# EAGLE schematic schema_v4_3 (EAGLE 6.5.0)
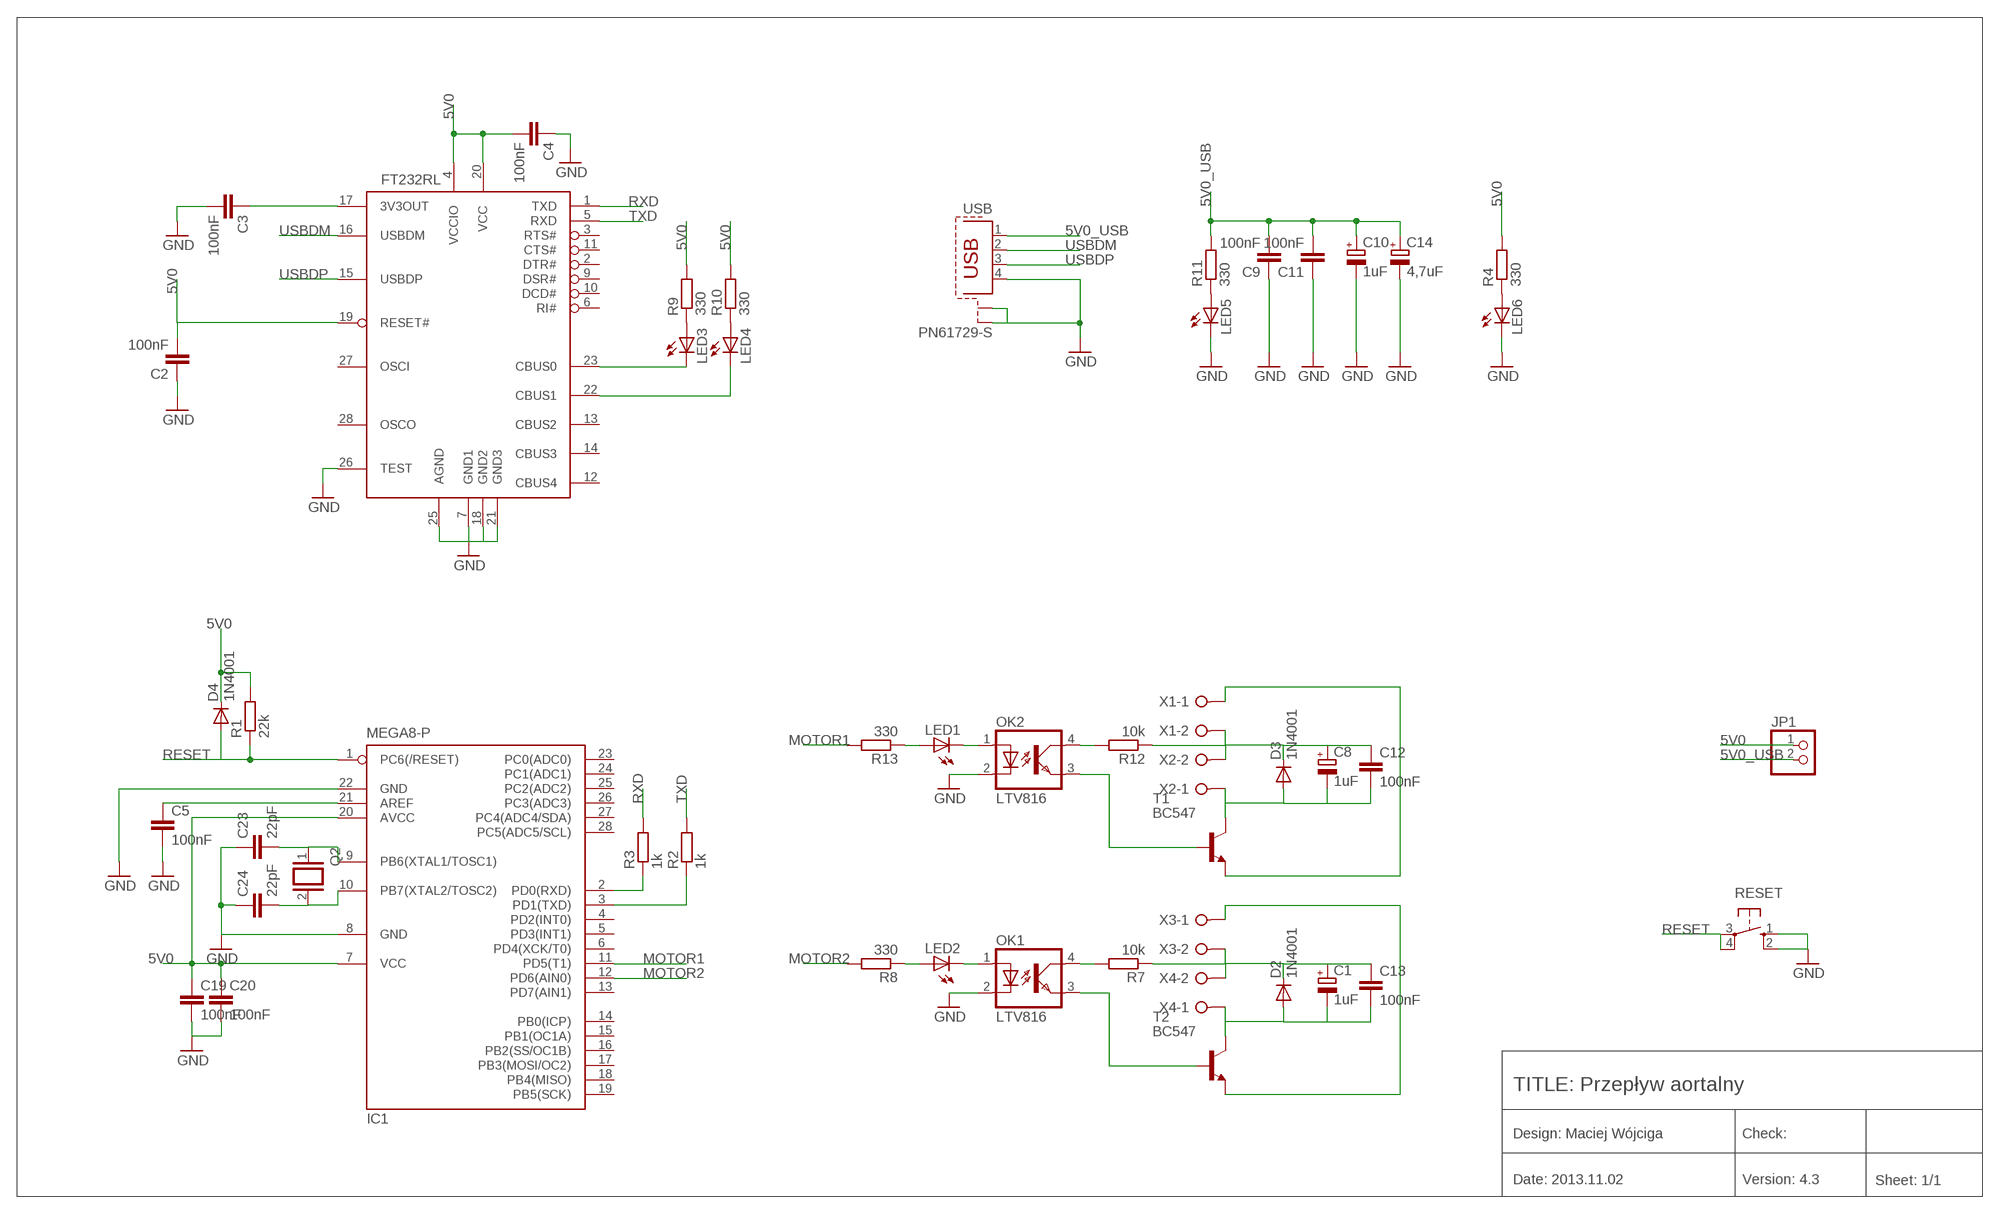
[diagram p0: schematic, sheet 1]

## Parts
C1  1uF  CPOL-EUE2.5-5  [E2,5-5]
C2  100nF  C-EU025-025X050  [C025-025X050]
C3  100nF  C-EU025-025X050  [C025-025X050]
C4  100nF  C-EU025-025X050  [C025-025X050]
C5  100nF  C-EU025-025X050  [C025-025X050]
C8  1uF  CPOL-EUE2.5-5  [E2,5-5]
C9  100nF  C-EU025-025X050  [C025-025X050]
C10  1uF  CPOL-EUE2.5-5  [E2,5-5]
C11  100nF  C-EU025-025X050  [C025-025X050]
C12  100nF  C-EU025-025X050  [C025-025X050]
C13  100nF  C-EU025-025X050  [C025-025X050]
C14  4,7uF  CPOL-EUE2.5-5  [E2,5-5]
C19  100nF  C-EU025-025X050  [C025-025X050]
C20  100nF  C-EU025-025X050  [C025-025X050]
C23  22pF  C-EU025-025X050  [C025-025X050]
C24  22pF  C-EU025-025X050  [C025-025X050]
D2  1N4001  1N4004  [DO41-10]
D3  1N4001  1N4004  [DO41-10]
D4  1N4001  1N4004  [DO41-10]
FT232RL  FT232RL  [SSOP28DB]
IC1  MEGA8-P  [DIL28-3]
JP1  PINHD-1X2  [1X02]
LED1  LED3MM  [LED3MM]
LED2  LED3MM  [LED3MM]
LED3  LED3MM  [LED3MM]
LED4  LED3MM  [LED3MM]
LED5  LED3MM  [LED3MM]
LED6  LED3MM  [LED3MM]
OK1  LTV816  [DIL04]
OK2  LTV816  [DIL04]
Q2  XTAL/S  [QS]
R1  22k  R-EU_0207/10  [0207/10]
R2  1k  R-EU_0207/10  [0207/10]
R3  1k  R-EU_0207/10  [0207/10]
R4  330  R-EU_0207/10  [0207/10]
R7  10k  R-EU_0207/10  [0207/10]
R8  330  R-EU_0207/10  [0207/10]
R9  330  R-EU_0207/10  [0207/10]
R10  330  R-EU_0207/10  [0207/10]
R11  330  R-EU_0207/10  [0207/10]
R12  10k  R-EU_0207/10  [0207/10]
R13  330  R-EU_0207/10  [0207/10]
RESET  10-XX  [B3F-10XX]
T1  BC547  [TO92]
T2  BC547  [TO92]
USB  PN61729-S  [PN61729-S]
X1  W237-02P  [W237-132]
X2  W237-02P  [W237-132]
X3  W237-02P  [W237-132]
X4  W237-02P  [W237-132]

## Nets
5V0: C2.2 C4.2 C19.1 C20.1 D4.C FT232RL.4(VCCIO) FT232RL.19(RESET#) FT232RL.20(VCC) IC1.7(VCC) IC1.20(AVCC) JP1.1 R1.2 R4.2 R9.2 R10.2
5V0_USB: C9.2 C10.+ C11.2 C14.+ JP1.2 R11.2 USB.1
GND: C2.1 C3.2 C4.1 C5.2 C9.1 C10.- C11.1 C14.- C19.2 C20.2 C23.1 C24.1 FT232RL.7(GND1) FT232RL.18(GND2) FT232RL.21(GND3) FT232RL.25(AGND) FT232RL.26(TEST) IC1.8(GND) IC1.22(GND) LED5.K(C) LED6.K(C) OK1.2(C) OK2.2(C) RESET.1(S) RESET.2(S1) USB.4 USB.S1 USB.S2
MOTOR1: IC1.11(PD5(T1)) R13.2
MOTOR2: IC1.12(PD6(AIN0)) R8.2
N$1: IC1.3(PD1(TXD)) R2.1
N$2: IC1.2(PD0(RXD)) R3.1
N$3: LED6.A R4.1
N$4: LED1.A R13.1
N$5: LED1.K(C) OK2.1(A)
N$6: LED2.A R8.1
N$8: LED3.A R9.1
N$9: LED4.A R10.1
N$10: LED5.A R11.1
N$11: C1.+ C13.1 D2.C R7.1 X3.2 X4.2
N$12: LED2.K(C) OK1.1(A)
N$13: C1.- C13.2 D2.A T2.3(C) X4.1
N$14: OK1.3(EMIT) T2.2(B)
N$15: OK2.4(COL) R12.2
N$16: T1.1(E) X1.1
N$17: C8.+ C12.1 D3.C R12.1 X1.2 X2.2
N$18: C8.- C12.2 D3.A T1.3(C) X2.1
N$19: OK2.3(EMIT) T1.2(B)
N$26: C5.1 IC1.21(AREF)
N$29: C23.2 IC1.9(PB6(XTAL1/TOSC1)) Q2.1
N$35: C24.2 IC1.10(PB7(XTAL2/TOSC2)) Q2.2
N$41: FT232RL.23(CBUS0) LED3.K(C)
N$42: FT232RL.22(CBUS1) LED4.K(C)
N$96: C3.1 FT232RL.17(3V3OUT)
N$104: OK1.4(COL) R7.2
N$107: T2.1(E) X3.1
RESET: D4.A IC1.1(PC6(/RESET)) R1.1 RESET.3(P) RESET.4(P1)
RXD: FT232RL.1(TXD) R3.2
TXD: FT232RL.5(RXD) R2.2
USBDM: FT232RL.16(USBDM) USB.2
USBDP: FT232RL.15(USBDP) USB.3
Unconnected: FT232RL.2(DTR#) FT232RL.3(RTS#) FT232RL.6(RI#) FT232RL.9(DSR#) FT232RL.10(DCD#) FT232RL.11(CTS#) FT232RL.12(CBUS4) FT232RL.13(CBUS2) FT232RL.14(CBUS3) FT232RL.27(OSCI) FT232RL.28(OSCO) IC1.4(PD2(INT0)) IC1.5(PD3(INT1)) IC1.6(PD4(XCK/T0)) IC1.13(PD7(AIN1)) IC1.14(PB0(ICP)) IC1.15(PB1(OC1A)) IC1.16(PB2(SS/OC1B)) IC1.17(PB3(MOSI/OC2)) IC1.18(PB4(MISO)) IC1.19(PB5(SCK)) IC1.23(PC0(ADC0)) IC1.24(PC1(ADC1)) IC1.25(PC2(ADC2)) IC1.26(PC3(ADC3)) IC1.27(PC4(ADC4/SDA)) IC1.28(PC5(ADC5/SCL))

## Notes on the sheet
- TITLE: Przepływ aortalny
- Design: Maciej Wójciga | Check:
- Date: 2013.11.02 | Version: 4.3 | Sheet: 1/1

## Library data of the parts
C1 C8 C10 C14 = rcl:CPOL-EU: POLARIZED CAPACITOR, European symbol
C2-C5 C9 C11-C13 C19 C20 C23 C24 = rcl:C-EU: CAPACITOR, European symbol
D2-D4 = diode:1N4004: DIODE general purpose rectifier, 1 A
FT232RL = ftdichip-5:FT232RL: USB UART 4th Generation USB UART (USB <-> Serial) Controller
IC1 = atmel:MEGA8-P: MICROCONTROLLER 8 Kbytes FLASH, 1 kbytes SRAM, 512 bytes EEPROM, USART, 4-channel 10 bit ADC, 2-channel 8 bit ADC Pin compatible with Atmega48, ATMega88, ATMega168 Source: avr.lbr; OC_FARNELL: unknown; OC_NEWARK: unknown
JP1 = pinhead:PINHD-1X2: PIN HEADER
LED1-LED6 = led:LED: LED OSRAM: - CHIPLED LG R971, LG N971, LY N971, LG Q971, LY Q971, LO R971, LY R971 LH N974, LH R974 LS Q976, LO Q976, LY Q976 LO Q996 - Hyper CHIPLED LW Q18S LB Q993, LB Q99A, LB R99A - SideLED LS A670, LO A670, LY A670, LG A670, LP A670 LB A673, LV A673, LT A673, LW A673 LH A674 LY A675 LS A676, LA A676, LO A676, LY A676, LW A676 LS A679, LY A679, LG A679 - Hyper Micro SIDELED® LS Y876, LA Y876, LO Y876, LY Y876 LT Y87S - SmartLED LW L88C, LW L88S LB L89C, LB L89S, LG L890 LS L89K, LO L89K, LY L89K LS L896, LA L896, LO L896, LY L896 - TOPLED LS T670, LO T670, LY T670, LG T670, LP T670 LSG T670, LSP T670, LSY T670, LOP T670, LYG T670 LG T671, LOG T671, LSG T671 LB T673, LV T673, LT T673, LW T673 LH T674 LS T676, LA T676, LO T676, LY T676, LB T676, LH T676, LSB T676, LW T676 LB T67C, LV T67C, LT T67C, LS T67K, LO T67K, LY T67K, LW E67C LS E67B, LA E67B, LO E67B, LY E67B, LB E67C, LV E67C, LT E67C LW T67C LS T679, LY T679, LG T679 LS T770, LO T770, LY T770, LG T770, LP T770 LB T773, LV T773, LT T773, LW T773 LH T774 LS E675, LA E675, LY E675, LS T675 LS T776, LA T776, LO T776, LY T776, LB T776 LHGB T686 LT T68C, LB T68C - Hyper Mini TOPLED® LB M676 - Mini TOPLED Santana® LG M470 LS M47K, LO M47K, LY M47K Source: http://www.osram.convergy.de LUXEON: - LUMILED® LXK2-PW12-R00, LXK2-PW12-S00, LXK2-PW14-U00, LXK2-PW14-V00 LXK2-PM12-R00, LXK2-PM12-S00, LXK2-PM14-U00 LXK2-PE12-Q00, LXK2-PE12-R00, LXK2-PE12-S00, LXK2-PE14-T00, LXK2-PE14-U00 LXK2-PB12-K00, LXK2-PB12-L00, LXK2-PB12-M00, LXK2-PB14-N00, LXK2-PB14-P00, LXK2-PB14-Q00 LXK2-PR12-L00, LXK2-PR12-M00, LXK2-PR14-Q00, LXK2-PR14-R00 LXK2-PD12-Q00, LXK2-PD12-R00, LXK2-PD12-S00 LXK2-PH12-R00, LXK2-PH12-S00 LXK2-PL12-P00, LXK2-PL12-Q00, LXK2-PL12-R00 Source: www.luxeon.com KINGBRIGHT: KA-3528ASYC Source: www.kingbright.com
OK1 OK2 = optocoupler:LTV816: OPTO COUPLER Source: LITEON, LTV816.pdf; OC_FARNELL: unknown; OC_NEWARK: unknown
Q2 = special:XTAL/S: CRYSTAL
R1-R4 R7-R13 = rcl:R-EU_: RESISTOR, European symbol
RESET = switch-omron:10-XX: OMRON SWITCH; MPN: B3F-1000; OC_FARNELL: 176432; OC_NEWARK: 36M3542
T1 T2 = transistor:BC547: NPN TRANSISTOR
USB = con-berg:PN61729-S: BERG USB connector; OC_FARNELL: unknown; OC_NEWARK: unknown
X1-X4 = con-wago-508:W237-02P: WAGO SREW CLAMP; OC_FARNELL: unknown; OC_NEWARK: unknown

## Net classes
0 default: width 0.203 mm